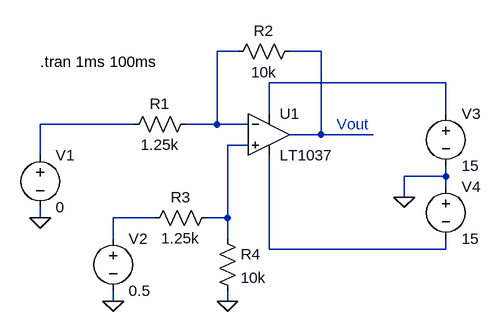
[diagram p0: schematic scheme1.asc]
scheme1.asc, the LTspice schematic file:
Version 4.1
SHEET 1 880 680
WIRE 304 -32 272 -32
WIRE 432 -32 384 -32
WIRE 624 16 352 16
WIRE 352 64 352 16
WIRE 624 64 624 16
WIRE 144 80 0 80
WIRE 272 80 272 -32
WIRE 272 80 224 80
WIRE 320 80 272 80
WIRE 432 96 432 -32
WIRE 432 96 384 96
WIRE 512 96 432 96
WIRE 320 112 288 112
WIRE 0 128 0 80
WIRE 624 160 624 144
WIRE 624 160 560 160
WIRE 624 176 624 160
WIRE 560 192 560 160
WIRE 0 224 0 208
WIRE 176 224 112 224
WIRE 288 224 288 112
WIRE 288 224 256 224
WIRE 112 256 112 224
WIRE 288 256 288 224
WIRE 352 272 352 128
WIRE 624 272 624 256
WIRE 624 272 352 272
WIRE 112 352 112 336
WIRE 288 352 288 336
FLAG 0 224 0
FLAG 112 352 0
FLAG 288 352 0
FLAG 560 192 0
SYMBOL voltage 0 112 R0
WINDOW 123 0 0 Left 0
WINDOW 39 0 0 Left 0
SYMATTR InstName V1
SYMATTR Value 0
SYMBOL voltage 112 240 R0
SYMATTR InstName V2
SYMATTR Value 0.5
SYMBOL res 240 64 R90
WINDOW 0 0 56 VBottom 2
WINDOW 3 32 56 VTop 2
SYMATTR InstName R1
SYMATTR Value 1.25k
SYMBOL res 400 -48 R90
WINDOW 0 0 56 VBottom 2
WINDOW 3 32 56 VTop 2
SYMATTR InstName R2
SYMATTR Value 10k
SYMBOL res 272 208 R90
WINDOW 0 0 56 VBottom 2
WINDOW 3 32 56 VTop 2
SYMATTR InstName R3
SYMATTR Value 1.25k
SYMBOL res 272 240 R0
SYMATTR InstName R4
SYMATTR Value 10k
SYMBOL OpAmps\\LT1037 352 32 R0
SYMATTR InstName U1
SYMBOL voltage 624 48 R0
SYMATTR InstName V3
SYMATTR Value 15
SYMBOL voltage 624 160 R0
SYMATTR InstName V4
SYMATTR Value 15
TEXT 0 -16 Left 2 !.tran 1ms 100ms
TEXT 456 80 Left 2 ;Vout

The netlist it stands for:
* scheme1.asc
V1 N004 0 0
V2 N006 0 0.5
R1 N001 N004 1.25k
R2 N002 N001 10k
R3 N005 N006 1.25k
R4 N005 0 10k
X§U1 N005 N001 N003 N007 N002 LT1037  ; pins In+ In- V+ V- OUT
V3 N003 0 15
V4 0 N007 15
.tran 1ms 100ms
* Vout
.backanno
.end